# EAGLE design catch the light initial (EAGLE 9.5.0)
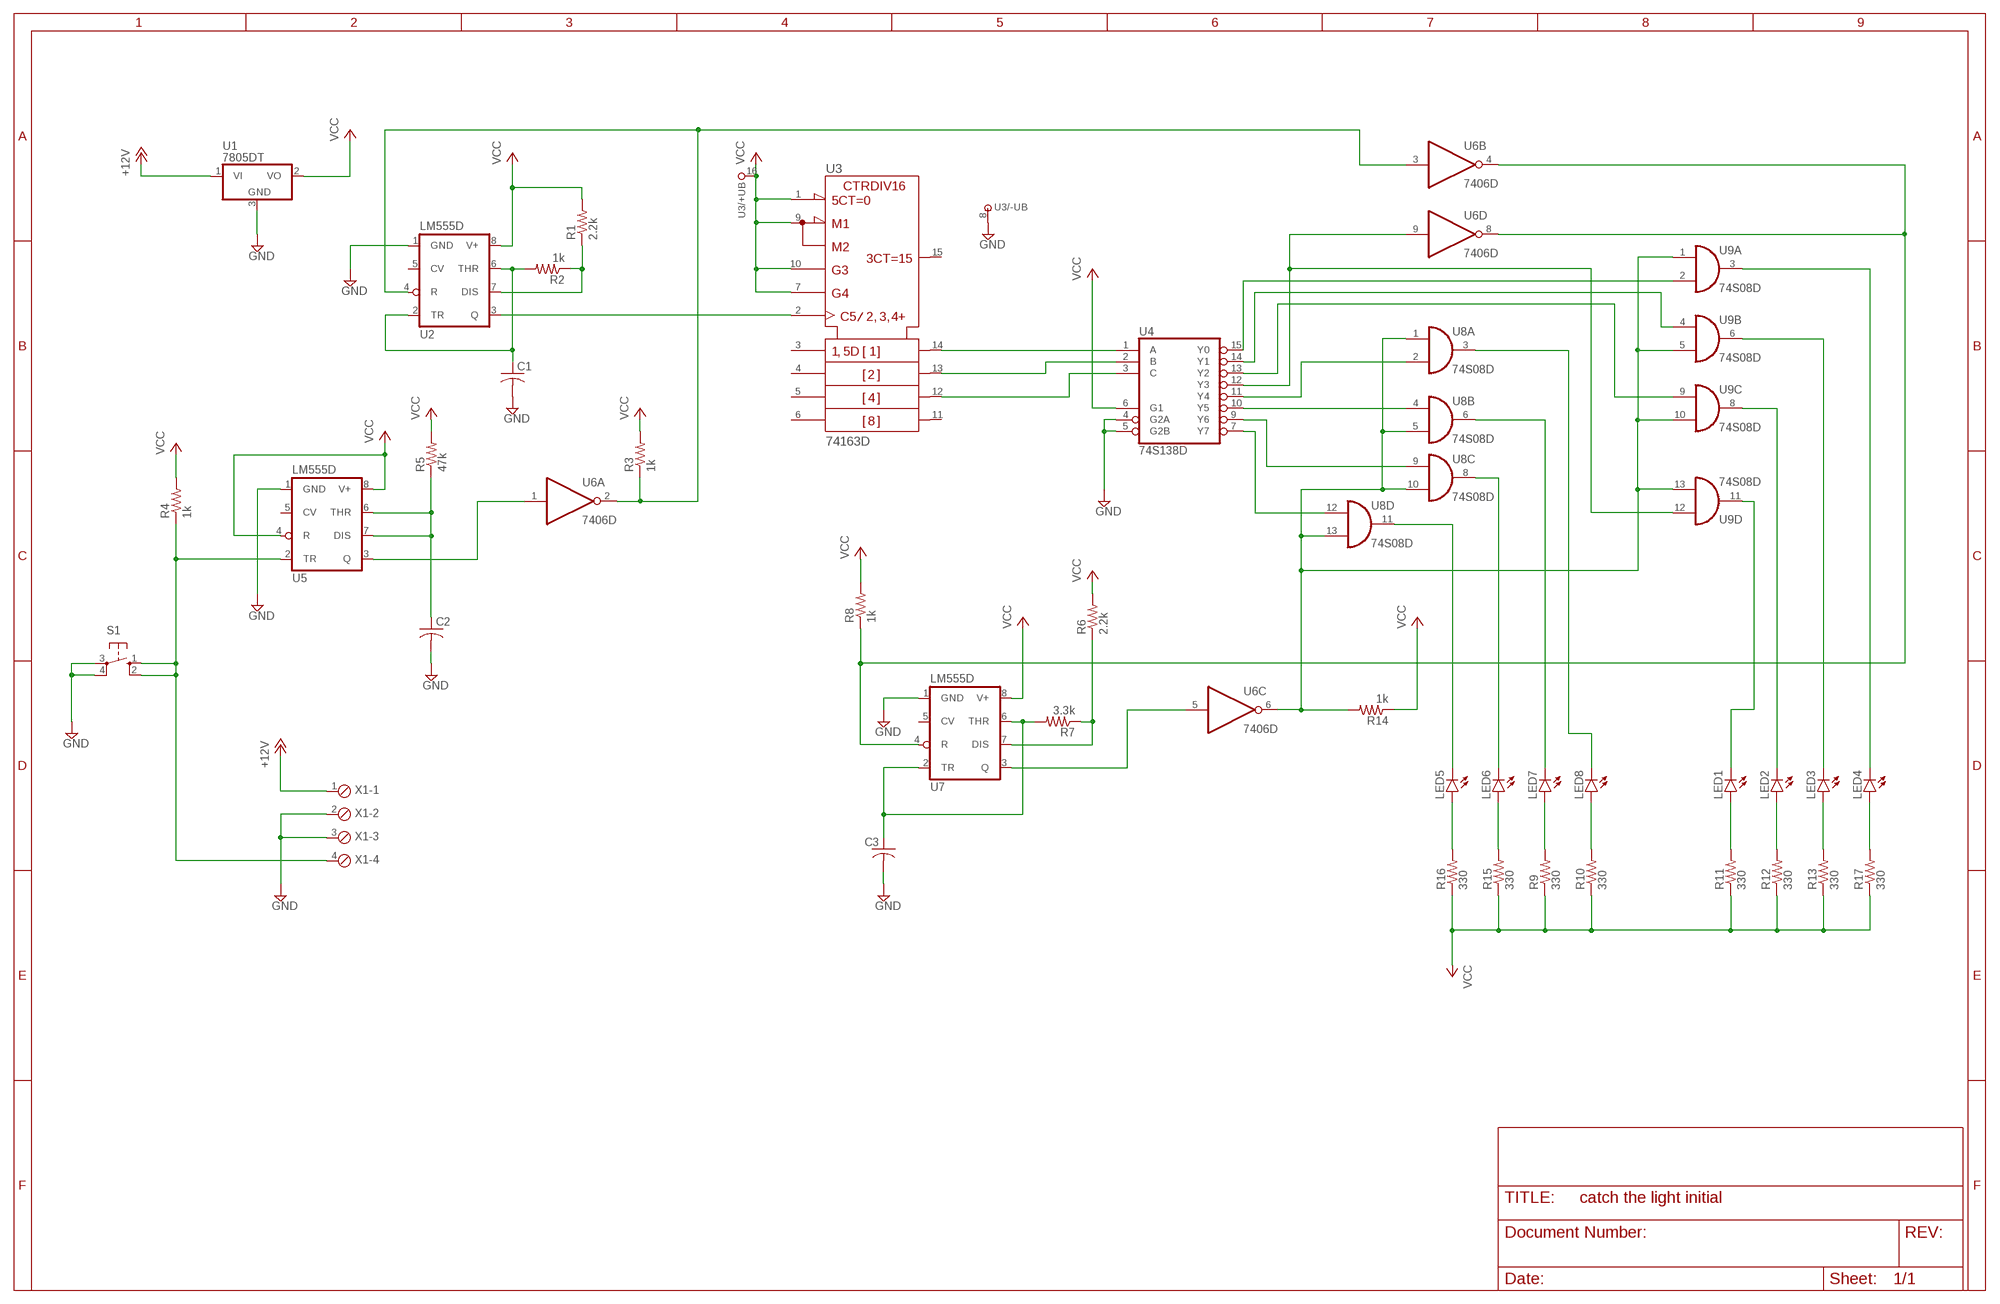
[diagram p0: schematic, sheet 1]

## Parts
C1  C-USC0805  [C0805]
C2  C-USC0805  [C0805]
C3  C-USC0805  [C0805]
LED1  LEDCHIP-LED0805  [CHIP-LED0805]
LED2  LEDCHIP-LED0805  [CHIP-LED0805]
LED3  LEDCHIP-LED0805  [CHIP-LED0805]
LED4  LEDCHIP-LED0805  [CHIP-LED0805]
LED5  LEDCHIP-LED0805  [CHIP-LED0805]
LED6  LEDCHIP-LED0805  [CHIP-LED0805]
LED7  LEDCHIP-LED0805  [CHIP-LED0805]
LED8  LEDCHIP-LED0805  [CHIP-LED0805]
R1  2.2k  R-US_R0805  [R0805]
R2  1k  R-US_R0805  [R0805]
R3  1k  R-US_R0805  [R0805]
R4  1k  R-US_R0805  [R0805]
R5  47k  R-US_R0805  [R0805]
R6  2.2k  R-US_R0805  [R0805]
R7  3.3k  R-US_R0805  [R0805]
R8  1k  R-US_R0805  [R0805]
R9  330  R-US_R0805  [R0805]
R10  330  R-US_R0805  [R0805]
R11  330  R-US_R0805  [R0805]
R12  330  R-US_R0805  [R0805]
R13  330  R-US_R0805  [R0805]
R14  1k  R-US_R0805  [R0805]
R15  330  R-US_R0805  [R0805]
R16  330  R-US_R0805  [R0805]
R17  330  R-US_R0805  [R0805]
S1  10-XX  [B3F-10XX]
U1  7805DT  [TO252]
U2  LM555D  [SO08]
U3  74163D  [SO16]
U4  74S138D  [SO16]
U5  LM555D  [SO08]
U6  7406D  [SO14]
U7  LM555D  [SO08]
U8  74S08D  [SO14]
U9  74S08D  [SO14]
X1  MPT4  [4POL254]

## Nets
+12V: U1.1(VI) X1.1
GND [POWER]: C1.2 C2.2 C3.2 S1.3(P) S1.4(P1) U1.3(GND) U2.1(GND) U3.8(-UB) U4.4(G2A) U4.5(G2B) U5.1(GND) U7.1(GND) X1.2 X1.3
N$1: C1.1 R2.2 U2.2(TR) U2.6(THR)
N$3: U2.3(Q) U3.2(CLK)
N$4: R3.1 U2.4(R) U6.2(A:O) U6.3(B:I)
N$5: C2.1 R5.1 U5.6(THR) U5.7(DIS)
N$6: R1.1 R2.1 U2.7(DIS)
N$7: U3.14(QA) U4.1(A)
N$8: U5.3(Q) U6.1(A:I)
N$9: U3.13(QB) U4.2(B)
N$10: U3.12(QC) U4.3(C)
N$11: U4.7(Y7) U8.12(D:I0)
N$12: U4.9(Y6) U8.9(C:I0)
N$13: U4.10(Y5) U8.4(B:I0)
N$14: U4.11(Y4) U8.2(A:I1)
N$15: U4.12(Y3) U6.9(D:I) U9.12(D:I0)
N$16: U4.15(Y0) U9.2(A:I1)
N$17: U4.13(Y2) U9.9(C:I0)
N$18: U4.14(Y1) U9.4(B:I0)
N$19: R8.1 U6.4(B:O) U6.8(D:O) U7.4(R)
N$20: C3.1 R7.2 U7.2(TR) U7.6(THR)
N$21: R4.1 S1.1(S) S1.2(S1) U5.2(TR) X1.4
N$22: U6.5(C:I) U7.3(Q)
N$23: LED5.C U8.11(D:O)
N$24: R14.2 U6.6(C:O) U8.1(A:I0) U8.5(B:I1) U8.10(C:I1) U8.13(D:I1) U9.1(A:I0) U9.5(B:I1) U9.10(C:I1) U9.13(D:I1)
N$25: LED6.C U8.8(C:O)
N$26: LED7.C U8.6(B:O)
N$27: LED8.C U8.3(A:O)
N$28: LED1.C U9.11(D:O)
N$29: LED2.C U9.8(C:O)
N$30: LED3.C U9.6(B:O)
N$31: LED4.C U9.3(A:O)
N$32: LED5.A R16.2
N$33: LED6.A R15.2
N$34: LED7.A R9.2
N$35: LED4.A R17.2
N$36: LED8.A R10.2
N$37: LED1.A R11.2
N$38: LED2.A R12.2
N$39: LED3.A R13.2
N$40: R6.1 R7.1 U7.7(DIS)
VCC [POWER]: R1.2 R3.2 R4.2 R5.2 R6.2 R8.2 R9.1 R10.1 R11.1 R12.1 R13.1 R14.1 R15.1 R16.1 R17.1 U1.2(VO) U2.8(V+) U3.1(!CLR) U3.7(ENP) U3.9(!LOAD) U3.10(ENT) U3.16(+UB) U4.6(G1) U5.4(R) U5.8(V+) U7.8(V+)
Unconnected: U2.5(CV) U3.3(A) U3.4(B) U3.5(C) U3.6(D) U3.11(QD) U3.15(RCO) U5.5(CV) U6.10(E:O) U6.11(E:I) U6.12(F:O) U6.13(F:I) U7.5(CV)

## Power pins joined to a net without a drawn wire
GND: U4.8(GND) U6.7(P:GND) U8.7(P:GND) U9.7(P:GND)
VCC: U4.16(VCC) U6.14(P:VCC) U8.14(P:VCC) U9.14(P:VCC)

## Library data of the parts
C1-C3 = rcl:C-US: CAPACITOR, American symbol; SPICEPREFIX: C
LED1-LED8 = led:LED: LED OSRAM: - CHIPLED LG R971, LG N971, LY N971, LG Q971, LY Q971, LO R971, LY R971 LH N974, LH R974 LS Q976, LO Q976, LY Q976 LO Q996 - Hyper CHIPLED LW Q18S LB Q993, LB Q99A, LB R99A - SideLED LS A670, LO A670, LY A670, LG A670, LP A670 LB A673, LV A673, LT A673, LW A673 LH A674 LY A675 LS A676, LA A676, LO A676, LY A676, LW A676 LS A679, LY A679, LG A679 - Hyper Micro SIDELED® LS Y876, LA Y876, LO Y876, LY Y876 LT Y87S - SmartLED LW L88C, LW L88S LB L89C, LB L89S, LG L890 LS L89K, LO L89K, LY L89K LS L896, LA L896, LO L896, LY L896 - TOPLED LS T670, LO T670, LY T670, LG T670, LP T670 LSG T670, LSP T670, LSY T670, LOP T670, LYG T670 LG T671, LOG T671, LSG T671 LB T673, LV T673, LT T673, LW T673 LH T674 LS T676, LA T676, LO T676, LY T676, LB T676, LH T676, LSB T676, LW T676 LB T67C, LV T67C, LT T67C, LS T67K, LO T67K, LY T67K, LW E67C LS E67B, LA E67B, LO E67B, LY E67B, LB E67C, LV E67C, LT E67C LW T67C LS T679, LY T679, LG T679 LS T770, LO T770, LY T770, LG T770, LP T770 LB T773, LV T773, LT T773, LW T773 LH T774 LS E675, LA E675, LY E675, LS T675 LS T776, LA T776, LO T776, LY T776, LB T776 LHGB T686 LT T68C, LB T68C - Hyper Mini TOPLED® LB M676 - Mini TOPLED Santana® LG M470 LS M47K, LO M47K, LY M47K Source: http://www.osram.convergy.de LUXEON: - LUMILED® LXK2-PW12-R00, LXK2-PW12-S00, LXK2-PW14-U00, LXK2-PW14-V00 LXK2-PM12-R00, LXK2-PM12-S00, LXK2-PM14-U00 LXK2-PE12-Q00, LXK2-PE12-R00, LXK2-PE12-S00, LXK2-PE14-T00, LXK2-PE14-U00 LXK2-PB12-K00, LXK2-PB12-L00, LXK2-PB12-M00, LXK2-PB14-N00, LXK2-PB14-P00, LXK2-PB14-Q00 LXK2-PR12-L00, LXK2-PR12-M00, LXK2-PR14-Q00, LXK2-PR14-R00 LXK2-PD12-Q00, LXK2-PD12-R00, LXK2-PD12-S00 LXK2-PH12-R00, LXK2-PH12-S00 LXK2-PL12-P00, LXK2-PL12-Q00, LXK2-PL12-R00 Source: www.luxeon.com KINGBRIGHT: KA-3528ASYC Source: www.kingbright.com
R1-R17 = rcl:R-US_: RESISTOR, American symbol; SPICEPREFIX: R
S1 = switch-omron:10-XX: OMRON SWITCH; MPN: B3F-1000; OC_FARNELL: 176432; OC_NEWARK: 36M3542
U1 = linear:78*: Positive VOLTAGE REGULATOR Source: http://cache.national.com/ds/LM/LM78L05.pdf http://www.fairchildsemi.com/ds/LM/LM7805.pdf
U2 U5 U7 = linear:*555: TIMER
U3 = jay:74*163: Synchrounus 4-bit COUNTER
U4 = 74xx-eu:74*138: 3-line to 8-line DECODER/DEMULTIPLEXER
U6 = 74xx-eu:74*06: Hex INVERTER, open collector high-voltage output
U8 U9 = 74xx-eu:74*08: Quad 2-input AND gate
X1 = con-phoenix-254:MPT4: PHOENIX CONNECTOR; OC_FARNELL: unknown; OC_NEWARK: unknown

## Net classes
0 default: width 0.254 mm
1 POWER: width 0.254 mm

## Board
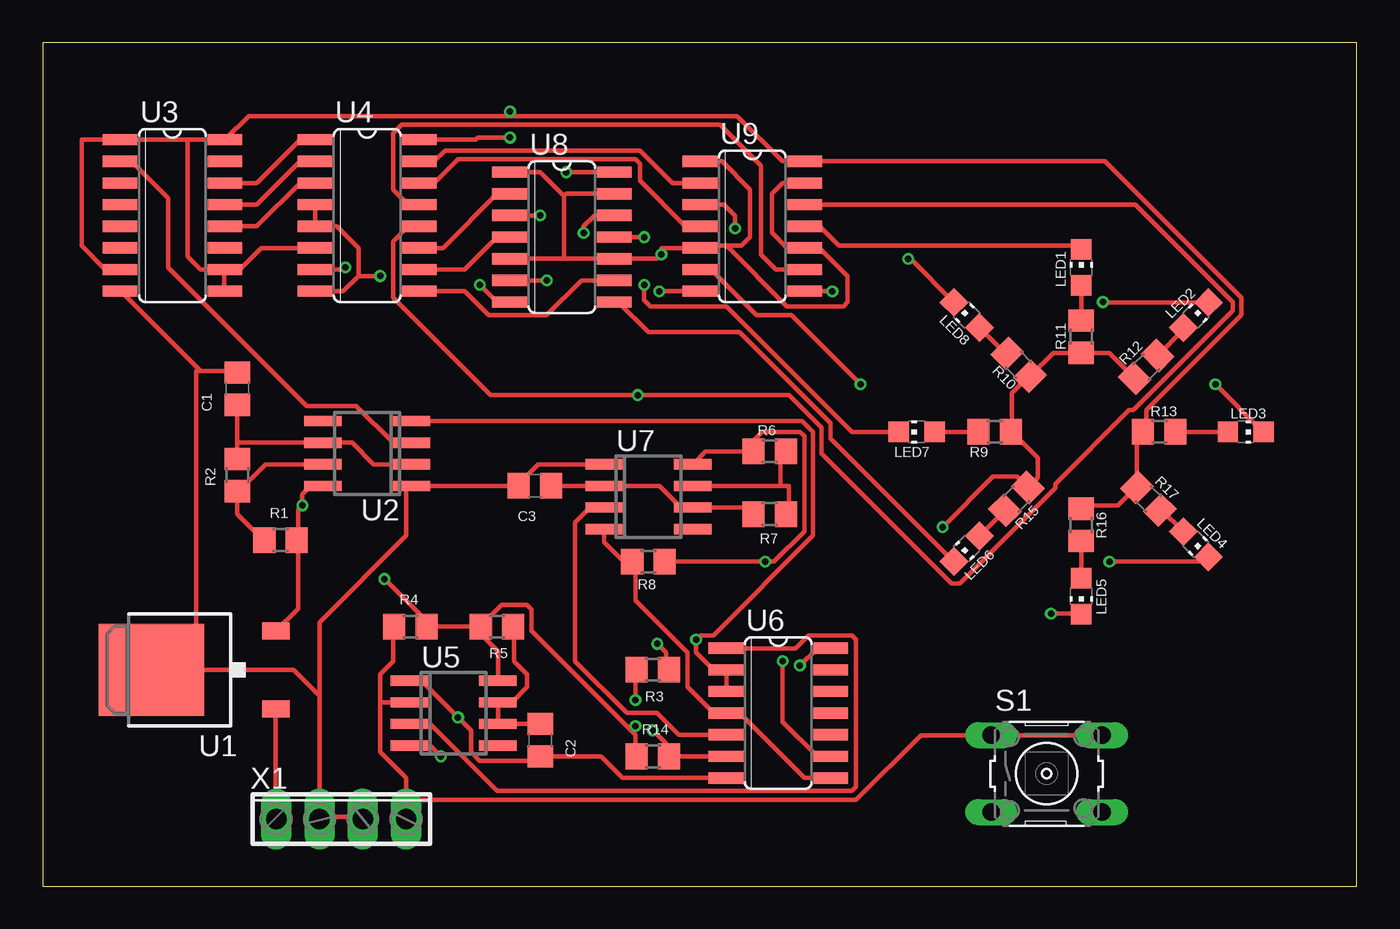
[diagram p1: board, top side]
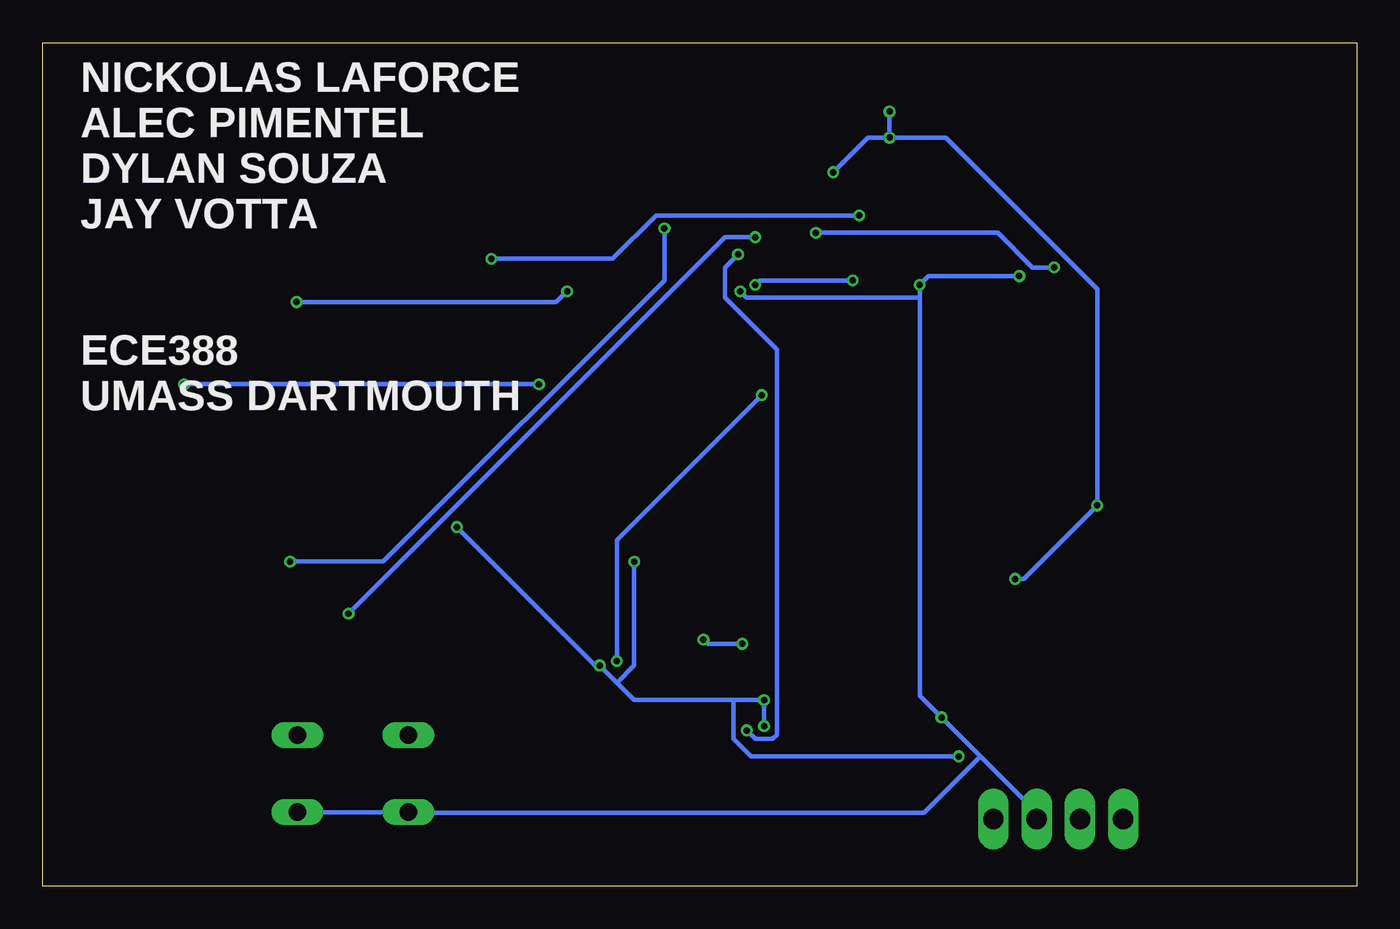
[diagram p2: board, bottom side, seen from below]

Size 77.14 x 49.52 mm. Coordinates in mm from the lower left corner, seen from the top.
Outline: 0,0 77.14,0 77.14,49.52 0,49.52 0,0
Copper layers (1*16): Top 0.035mm / dielectric 1.5mm / Bottom 0.035mm
Design rules "Dirty8TS": minimum track width 8mil, minimum drill 15mil, track to track 8mil, track to pad 8mil, pad to pad 8mil, via to via 8mil, smd to smd 0mil, copper to edge 10mil, drill to drill 10mil, minimum pad ring 10mil, minimum via ring 6mil, stop-mask expansion 2mil, vias tented up to drill 25mil, thermal gap 10mil

### Footprints (pad centres in the part's own frame; a part is rotated, then mirrored left to right if it is on the bottom)
C0805 = smd 1.3 x 1.5: 1 -0.95,0; 2 0.95,0
CHIP-LED0805 = smd 1.2 x 1.2: A 0,-1.05; C 0,1.05
R0805 = smd 1.3 x 1.5: 1 -0.95,0; 2 0.95,0
B3F-10XX = drill 1.016 long: 1 -3.251,2.261; 2 3.251,2.261; 3 -3.251,-2.261; 4 3.251,-2.261
TO252 = smd 1 x 1.6: 1 -2.28,-4.8; 2 2.28,-4.8 | smd 5.4 x 6.2: 3 0,2.5
SO08 = smd 0.6 x 2.2: 1 -1.905,-2.6; 2 -0.635,-2.6; 3 0.635,-2.6; 4 1.905,-2.6; 5 1.905,2.6; 6 0.635,2.6; 7 -0.635,2.6; 8 -1.905,2.6
SO16 = smd 0.66 x 2.032: 1 -4.445,-3.073; 2 -3.175,-3.073; 3 -1.905,-3.073; 4 -0.635,-3.073; 5 0.635,-3.073; 6 1.905,-3.073; 7 3.175,-3.073; 8 4.445,-3.073; 9 4.445,3.073; 10 3.175,3.073; 11 1.905,3.073; 12 0.635,3.073; 13 -0.635,3.073; 14 -1.905,3.073; 15 -3.175,3.073; 16 -4.445,3.073
SO14 = smd 0.66 x 2.032: 1 -3.81,-3.073; 2 -2.54,-3.073; 3 -1.27,-3.073; 4 0,-3.073; 5 1.27,-3.073; 6 2.54,-3.073; 7 3.81,-3.073; 8 3.81,3.073; 9 2.54,3.073; 10 1.27,3.073; 11 0,3.073; 12 -1.27,3.073; 13 -2.54,3.073; 14 -3.81,3.073
4POL254 = drill 1.2 long: 1 -3.81,0; 2 -1.27,0; 3 1.27,0; 4 3.81,0

### Placement (x,y rotation side)
C1  11.43,29.21 90 top
C2  29.21,8.57 270 top
C3  28.89,23.5 180 top
LED1  60.96,36.32 0 top
LED2  67.69,33.53 315 top
LED3  70.61,26.67 270 top
LED4  67.69,20.07 225 top
LED5  60.96,17.02 180 top
LED6  54.23,19.81 135 top
LED7  51.31,26.67 90 top
LED8  54.23,33.53 45 top
R1  13.97,20.32 0 top
R2  11.43,24.13 90 top
R3  35.81,12.7 180 top
R4  21.59,15.24 0 top
R5  26.67,15.24 180 top
R6  42.67,25.53 180 top
R7  42.67,21.84 180 top
R8  35.56,19.05 0 top
R9  55.88,26.67 180 top
R10  57.28,30.61 135 top
R11  60.96,32.26 90 top
R12  64.77,30.48 45 top
R13  65.53,26.67 0 top
R14  35.81,7.62 0 top
R15  57.15,22.73 225 top
R16  60.96,21.21 270 top
R17  64.9,22.73 315 top
S1  58.93,6.6 0 top
U1  8.89,12.7 90 top
U2  19.05,25.4 90 top
U3  7.62,39.37 270 top
U4  19.05,39.37 270 top
U5  24.13,10.16 270 top
U6  43.18,10.16 270 top
U7  35.56,22.86 270 top
U8  30.48,38.1 270 top
U9  41.66,38.73 270 top
X1  17.53,3.94 0 top

### Tracks (layer width: path | path; a pad name or v marks a point on that pad's centre or on a via)
+12V
  Top 0.254: U1.1 13.69,3.96 X1.1
GND  (via drill 0.38)
  Top 0.254: U7.1 29.08,24.77 27.94,23.62 C3.2 U2.1 21.34,23.5 21.34,20.57 16.26,15.49 16.26,11.18 | 9.27,30.23 9.02,30.23 9.02,12.7 | 9.27,30.23 11.43,30.23 C1.2 | 9.27,30.23 4.57,34.92 U3.8 | 9.02,12.7 14.73,12.7 16.26,11.18 | 9.02,12.7 U1.3 | U6.7 34.04,6.35 32.77,7.62 C2.2 28.96,7.37 25.65,7.37 25.15,7.87 25.15,9.14 v24.38,9.91 22.23,12.06 U5.1 | U4.8 17.65,34.92 18.54,35.81 | 18.54,35.81 18.54,37.47 17.27,38.73 U4.5 16,38.76 16,39.98 U4.4 | U8.7 26.67,34.29 v25.65,35.31 | U9.7 v36.2,34.92 | 16.26,4.06 18.8,4.06 X1.3 | v19.81,35.81 18.54,35.81 | 16.26,4.06 16.26,11.18 | 16.26,4.06 X1.2
  Bottom 0.254: 25.65,34.54 25.65,11.18 v24.38,9.91 22.1,7.62 | 25.65,34.54 v25.65,35.31 25.15,35.81 v19.81,35.81 | 22.1,7.62 18.8,4.32 X1.3 | v36.2,34.92 35.81,34.54 25.65,34.54 | 22.1,7.62 25.4,4.32 55.7,4.32 S1.3 S1.4
N$1
  Top 0.254: C1.1 11.43,26.04 | 11.43,26.04 R2.2 | U2.2 19.43,24.77 18.16,26.04 U2.6 11.43,26.04
N$3
  Top 0.254: U3.2 5.21,42.55 7.37,40.39 7.37,36.32 15.49,28.19 18.41,28.19 20.57,26.04 U2.3
N$4  (via drill 0.38)
  Top 0.254: v36.07,14.22 36.58,13.72 36.58,12.7 R3.1 | U6.3 40.13,11.43 40.13,12.7 U6.2 39.37,12.7 38.35,13.72 v38.35,14.48 38.61,14.73 39.37,14.73 45.21,20.57 45.21,26.67 44.58,27.3 U2.4
  Bottom 0.254: v36.07,14.22 38.1,14.22 v38.35,14.48
N$5
  Top 0.254: C2.1 U5.6 U5.7 27.56,10.79 28.45,11.68 28.45,12.45 27.69,13.21 27.69,15.24 R5.1
N$6
  Top 0.254: 11.43,23.11 11.43,21.84 12.95,20.32 R1.1 | U2.7 13.08,24.77 11.43,23.11 | 11.43,23.11 R2.1
N$7
  Top 0.254: U3.14 12.57,41.27 15.11,43.81 U4.1
N$8
  Top 0.254: U6.1 44.2,13.97 44.96,14.73 47.5,14.73 47.75,14.48 47.75,5.84 47.5,5.59 26.67,5.59 22.73,9.53 U5.3
N$9
  Top 0.254: U3.13 12.57,40.01 15.11,42.55 U4.2
N$10
  Top 0.254: U3.12 12.57,38.73 15.11,41.27 U4.3
N$11  (via drill 0.38)
  Top 0.254: v17.78,36.32 17.65,36.2 U4.7 | v31.75,38.35 31.75,38.73 32.38,39.37 U8.12
  Bottom 0.254: v17.78,36.32 19.05,36.32 21.08,38.35 v31.75,38.35
N$12
  Top 0.254: U4.9 24.77,34.92 26.16,33.53 29.59,33.53 31.62,35.56 U8.9
N$13
  Top 0.254: U4.10 24.77,36.2 26.67,38.1 U8.4
N$14
  Top 0.254: U4.11 23.5,37.47 26.67,40.64 U8.2
N$15  (via drill 0.38)
  Top 0.254: U6.9 45.47,7.62 43.43,9.65 v43.43,13.21 | U4.12 21.46,38.73 20.57,37.85 20.57,34.54 26.29,28.83 v34.92,28.83 43.81,28.83 45.72,26.92 45.72,25.4 53.34,17.78 53.85,17.78 59.44,23.37 59.44,23.62 63.75,27.94 64.01,27.94 69.85,33.78 69.85,34.29 64.14,40.01 U9.12
  Bottom 0.254: v43.43,13.21 43.43,20.32 v34.92,28.83
N$16
  Top 0.254: U9.2 36.96,41.27 35.05,43.18 23.62,43.18 22.99,42.55 U4.15
N$17
  Top 0.254: U9.9 43.05,36.2 42.16,37.08 42.16,42.29 39.75,44.7 21.08,44.7 20.57,44.2 20.57,40.89 21.46,40.01 U4.13
N$18
  Top 0.254: U9.4 37.72,38.73 35.05,41.4 35.05,42.42 34.8,42.67 24.38,42.67 22.99,41.27 U4.14
N$19
  Top 0.254: U7.4 32.96,20.19 34.1,19.05 R8.1 34.8,19.05 34.8,16.76 37.85,13.72 37.85,11.68 39.37,10.16 U6.4 40.89,10.16 44.7,6.35 U6.8
N$20
  Top 0.254: C3.1 U7.2 36.2,23.5 37.47,22.23 U7.6 41.34,22.23 R7.2
N$21
  Top 0.254: 19.81,10.92 19.94,10.79 U5.2 | R4.1 20.57,15.24 20.57,13.21 19.81,12.45 19.81,10.92 | 21.34,5.08 21.34,6.35 19.81,7.87 19.81,10.92 | 21.34,5.08 47.75,5.08 51.54,8.87 S1.1 S1.2 | 21.34,5.08 X1.4
N$22
  Top 0.254: U6.5 37.34,8.89 36.07,10.16 34.29,10.16 31.24,13.21 31.24,21.34 32.13,22.23 U7.3
N$23  (via drill 0.38)
  Top 0.254: v59.18,16 60.96,16 LED5.C | U8.11 v35.31,38.1
  Bottom 0.254: v59.18,16 37.08,38.1 v35.31,38.1
N$24  (via drill 0.38)
  Top 0.254: U9.13 43.43,41.27 42.8,40.64 42.8,38.35 43.69,37.47 U9.10 45.59,37.47 47.24,35.81 47.24,34.29 46.99,34.04 43.69,34.04 40.13,37.59 | U6.6 R14.2 36.58,7.62 36.58,8.38 v35.81,9.14 | 30.61,36.83 U8.10 36.07,36.83 v36.32,37.08 36.32,37.47 U9.5 38.71,37.59 40.13,37.59 | 30.61,36.83 U8.5 | U8.1 29.21,41.91 30.61,40.51 | 30.61,36.83 30.61,40.51 | U8.13 30.73,40.64 30.61,40.51 | U9.1 39.88,42.55 41.53,40.89 41.53,38.1 41.02,37.59 40.13,37.59
  Bottom 0.254: v35.81,9.14 35.31,8.64 34.29,8.64 34.04,8.89 34.04,31.5 37.08,34.54 37.08,36.32 v36.32,37.08
N$25
  Top 0.254: LED6.C 53.45,19.07 46.23,26.29 46.23,27.18 40.89,32.51 35.56,32.51 33.78,34.29 U8.8
N$26  (via drill 0.38)
  Top 0.254: LED7.C 47.5,26.67 40.13,34.04 35.69,34.04 35.31,34.42 v35.31,35.31 | v29.59,35.56 U8.6
  Bottom 0.254: v35.31,35.31 35.05,35.56 v29.59,35.56
N$27  (via drill 0.38)
  Top 0.254: LED8.C 50.93,36.83 v50.8,36.83 | LED8.C | U8.3 v29.21,39.37
  Bottom 0.254: v50.8,36.83 43.69,36.83 41.15,39.37 v29.21,39.37
N$28
  Top 0.254: U9.11 45.59,38.73 46.74,37.59 60.96,37.59 LED1.C
N$29  (via drill 0.38)
  Top 0.254: v46.35,34.92 U9.8 | LED2.C 62.21,34.27 v62.23,34.29
  Bottom 0.254: v62.23,34.29 46.99,34.29 v46.35,34.92
N$30  (via drill 0.38)
  Top 0.254: v68.83,29.46 71.63,26.67 LED3.C | v48.01,29.46 43.94,33.53 41.91,33.53 39.24,36.2 U9.6
  Bottom 0.254: v48.01,29.46 v68.83,29.46
N$31  (via drill 0.38)
  Top 0.254: LED4.C 68.16,19.05 v62.61,19.05 | v40.64,38.61 40.64,39.37 40.01,40.01 U9.3
  Bottom 0.254: v62.61,19.05 57.15,19.05 40.64,35.56 v40.64,38.61
N$32
  Top 0.254: R16.2 LED5.A
N$33
  Top 0.254: R15.2 LED6.A
N$34
  Top 0.254: R9.2 LED7.A
N$35
  Top 0.254: LED4.A 65.63,22.12 R17.2 | LED4.A
N$36
  Top 0.254: LED8.A 56.26,31.5 56.39,31.5 R10.2 | LED8.A
N$37
  Top 0.254: R11.2 LED1.A
N$38
  Top 0.254: LED2.A 66.95,32.66 R12.2
N$39
  Top 0.254: R13.2 LED3.A
N$40
  Top 0.254: R6.1 43.31,25.21 43.31,23.5 | R7.1 43.81,21.84 43.81,23.5 43.31,23.5 | 43.31,23.5 U7.7
VCC  (via drill 0.38)
  Top 0.254: 56.9,26.67 58.42,25.15 58.42,24 R15.1 57.19,24.04 55.79,24.04 v52.83,21.08 | R12.1 62.6,31.31 R11.1 59.32,31.31 R10.1 57.88,29.93 56.9,28.96 56.9,26.67 | 56.9,26.67 R9.1 | R8.2 v42.42,19.05 42.93,19.05 44.7,20.83 44.7,26.42 44.45,26.67 42.23,26.67 41.72,26.16 R6.2 38.92,25.53 U7.8 | 25.65,15.24 25.27,15.24 | 25.27,15.24 R4.2 22.35,15.24 22.35,15.75 v20.07,18.03 | 34.54,9.14 28.7,14.99 28.7,16.26 28.45,16.51 26.92,16.51 25.65,15.24 | 34.54,9.14 34.8,8.89 34.8,7.62 R14.1 | v34.8,10.92 34.8,12.7 R3.2 | 34.54,9.14 v34.8,9.4 | U6.14 45.47,13.97 v44.45,12.95 | U5.4 22.73,8.26 v23.37,7.62 | 25.27,15.24 26.73,13.78 U5.8 | 25.65,15.24 R5.2 | 14.99,20.32 14.99,22.1 v15.24,22.35 15.24,22.99 15.75,23.5 U2.8 | U1.2 14.99,16.28 14.99,20.32 | 14.99,20.32 R1.2 | v30.73,41.91 U8.14 | v27.43,43.94 25.53,43.94 25.4,43.81 U4.16 | U3.10 10.67,36.17 10.67,34.95 U3.9 | U4.6 12.83,37.47 11.56,36.2 U3.10 | R16.1 60.96,22.35 63.12,22.35 64.17,23.41 R17.1 64.22,26.31 R13.1 64.77,26.67 64.77,27.94 70.36,33.53 70.36,34.54 62.36,42.55 U9.14 43.43,42.55 40.77,45.21 27.43,45.21 | U3.7 3.68,36.2 2.29,37.59 2.29,43.81 U3.1 8.51,43.81 | 8.51,43.81 U3.16 12.09,45.21 27.43,45.21 | U3.10 9.27,36.2 8.51,36.96 8.51,43.81 | 27.43,45.21 v27.43,45.47
  Bottom 0.254: v34.8,9.4 v34.8,10.92 36.58,10.92 | 43.43,11.94 42.42,10.92 36.58,10.92 | 43.43,11.94 v44.45,12.95 44.7,12.95 v52.83,21.08 | v23.37,7.62 35.56,7.62 36.58,8.64 36.58,10.92 | v42.42,19.05 42.42,12.95 43.43,11.94 | v27.43,43.94 28.7,43.94 v30.73,41.91 | v27.43,43.94 24.13,43.94 15.24,35.05 v15.24,22.35 19.56,18.03 v20.07,18.03 | v27.43,45.47 v27.43,43.94

### Text on the board
bNames: NICKOLAS LAFORCE / ALEC PIMENTEL / DYLAN SOUZA / JAY VOTTA / / / ECE388 / UMASS DARTMOUTH